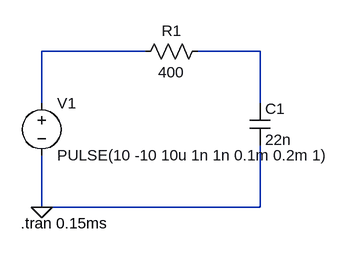
[diagram p0: schematic Draft1.asc]
Draft1.asc, the LTspice schematic file:
Version 4
SHEET 1 880 680
WIRE 176 48 16 48
WIRE 352 48 256 48
WIRE 16 128 16 48
WIRE 352 128 352 48
WIRE 16 288 16 208
WIRE 352 288 352 192
WIRE 352 288 16 288
FLAG 16 288 0
SYMBOL voltage 16 112 R0
WINDOW 123 0 0 Left 0
WINDOW 39 0 0 Left 0
SYMATTR InstName V1
SYMATTR Value PULSE(10 -10 10u 1n 1n 0.1m 0.2m 1)
SYMBOL res 272 32 R90
WINDOW 0 0 56 VBottom 2
WINDOW 3 32 56 VTop 2
SYMATTR InstName R1
SYMATTR Value 400
SYMBOL cap 336 128 R0
SYMATTR InstName C1
SYMATTR Value 22n
TEXT -16 312 Left 2 !.tran 0.15ms

The netlist it stands for:
* Draft1.asc
V1 N001 0 PULSE(10 -10 10u 1n 1n 0.1m 0.2m 1)
R1 N002 N001 400
C1 N002 0 22n
.tran 0.15ms
.backanno
.end